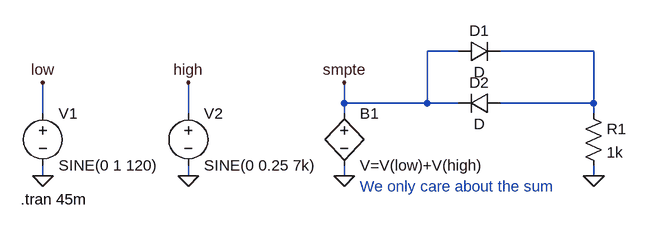
[diagram p0: schematic smpte.asc]
smpte.asc, the LTspice schematic file:
Version 4
SHEET 1 1448 680
WIRE 704 48 656 48
WIRE 912 48 768 48
WIRE 528 128 528 96
WIRE 656 128 656 48
WIRE 656 128 528 128
WIRE 704 128 656 128
WIRE 912 128 912 48
WIRE 912 128 768 128
WIRE 64 144 64 96
WIRE 288 144 288 96
WIRE 528 144 528 128
WIRE 912 144 912 128
WIRE 64 240 64 224
WIRE 288 240 288 224
WIRE 528 240 528 224
WIRE 912 240 912 224
FLAG 64 240 0
FLAG 288 240 0
FLAG 528 240 0
FLAG 64 96 low
FLAG 288 96 high
FLAG 528 96 smpte
FLAG 912 240 0
SYMBOL voltage 64 128 R0
WINDOW 123 0 0 Left 2
WINDOW 39 0 0 Left 2
SYMATTR InstName V1
SYMATTR Value SINE(0 1 120)
SYMBOL voltage 288 128 R0
WINDOW 123 0 0 Left 2
WINDOW 39 0 0 Left 2
SYMATTR InstName V2
SYMATTR Value SINE(0 0.25 7k)
SYMBOL bv 528 128 R0
SYMATTR InstName B1
SYMATTR Value V=V(low)+V(high)
SYMBOL res 896 128 R0
SYMATTR InstName R1
SYMATTR Value 1k
SYMBOL diode 704 64 R270
WINDOW 0 32 32 VTop 2
WINDOW 3 0 32 VBottom 2
SYMATTR InstName D1
SYMBOL diode 768 112 R90
WINDOW 0 0 32 VBottom 2
WINDOW 3 32 32 VTop 2
SYMATTR InstName D2
TEXT 552 256 Left 2 ;We only care about the sum
TEXT 30 276 Left 2 !.tran 45m

The netlist it stands for:
* smpte.asc
V1 low 0 SINE(0 1 120)
V2 high 0 SINE(0 0.25 7k)
B1 smpte 0 V=V(low)+V(high)
R1 N001 0 1k
D1 smpte N001 D
D2 N001 smpte D
.model D D
.lib standard.dio
* We only care about the sum
.tran 45m
.backanno
.end

* Results of the author's LTspice run, read from the files saved beside the schematic
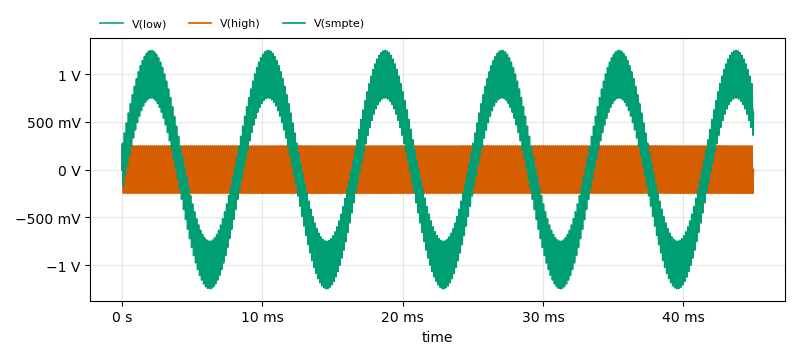
[diagram p1: Transient Analysis of smpte.asc, plotted from the saved traces]
* Transient Analysis, 1 run:
*   V(low): min -1 V, max 1 V, average 53.32 mV, rms 712 mV, last 587.8 mV
*   V(high): min -249.2 mV, max 249.2 mV, average 675.5 nV, rms 176.5 mV, last 0 V
*   V(smpte): min -1.249 V, max 1.249 V, average 53.32 mV, rms 733.5 mV, last 587.8 mV